# EAGLE design powerSwitch001 (EAGLE 5.10)

## Sheet 1 of 2
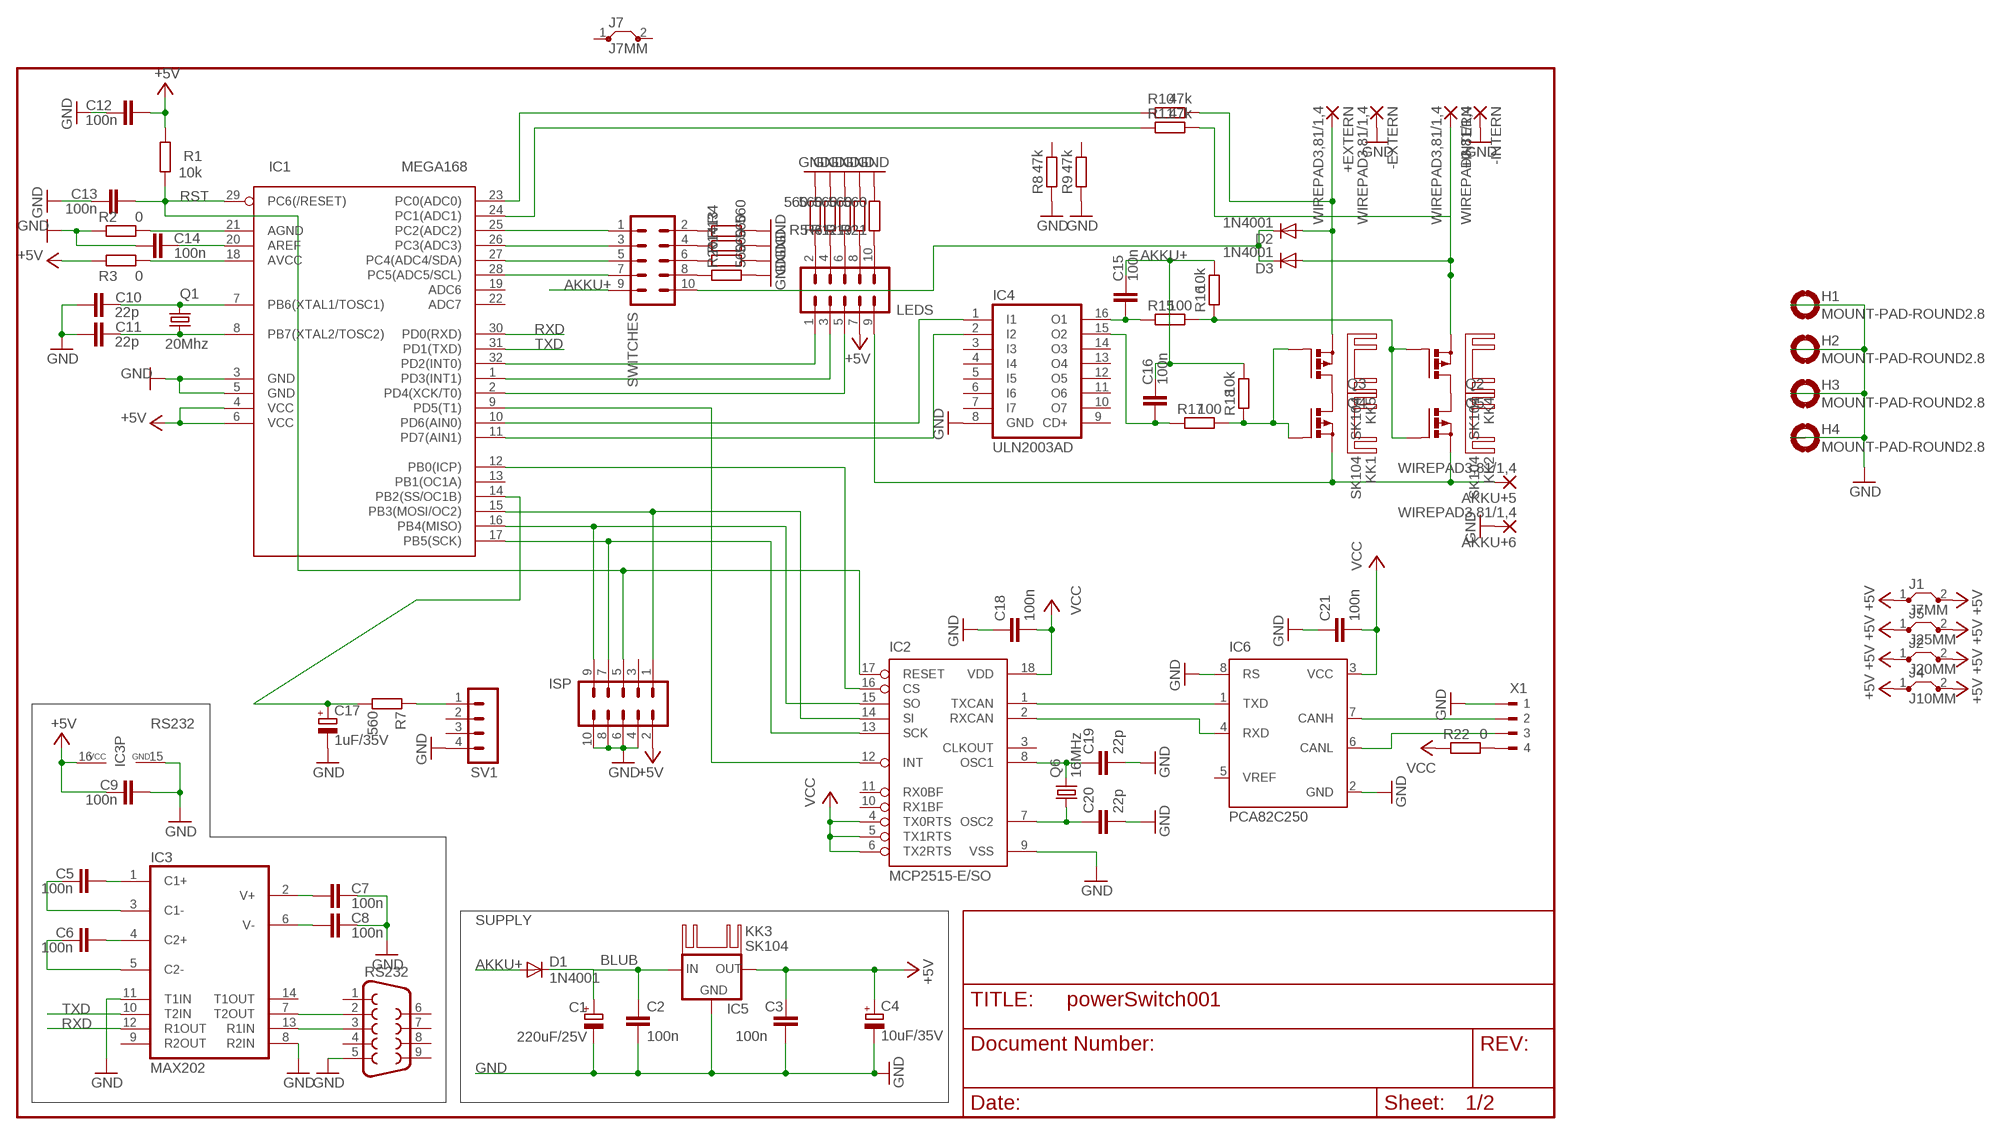
[diagram p0: schematic, sheet 1]

### Parts
+EXTERN  WIREPAD3,81/1,4  [3,81/1,4]
+INTERN  WIREPAD3,81/1,4  [3,81/1,4]
-EXTERN  WIREPAD3,81/1,4  [3,81/1,4]
-INTERN  WIREPAD3,81/1,4  [3,81/1,4]
AKKU+5  WIREPAD3,81/1,4  [3,81/1,4]
AKKU+6  WIREPAD3,81/1,4  [3,81/1,4]
C1  220uF/25V  CPOL-EUE3.5-8  [E3,5-8]
C2  100n  C-EUC0603K  [C0603K]
C3  100n  C-EUC0603K  [C0603K]
C4  10uF/35V  CPOL-EUE2-5  [E2-5]
C5  100n  C-EUC0603K  [C0603K]
C6  100n  C-EUC0603K  [C0603K]
C7  100n  C-EUC0603K  [C0603K]
C8  100n  C-EUC0603K  [C0603K]
C9  100n  C-EUC0603K  [C0603K]
C10  22p  C-EUC0603K  [C0603K]
C11  22p  C-EUC0603K  [C0603K]
C12  100n  C-EUC0603K  [C0603K]
C13  100n  C-EUC0603K  [C0603K]
C14  100n  C-EUC0603K  [C0603K]
C15  100n  C-EUC0603K  [C0603K]
C16  100n  C-EUC0603K  [C0603K]
C17  1uF/35V  CPOL-EUE2-5  [E2-5]
C18  100n  C-EUC0603  [C0603]
C19  22p  C-EUC0603  [C0603]
C20  22p  C-EUC0603  [C0603]
C21  100n  C-EUC0603  [C0603]
D1  1N4001  1N4004  [DO41-10]
D2  1N4001  1N4004  [DO41-10]
D3  1N4001  1N4004  [DO41-10]
H1  MOUNT-PAD-ROUND2.8  [2,8-PAD]
H2  MOUNT-PAD-ROUND2.8  [2,8-PAD]
H3  MOUNT-PAD-ROUND2.8  [2,8-PAD]
H4  MOUNT-PAD-ROUND2.8  [2,8-PAD]
IC1  MEGA168  MEGA8-AI  [TQFP32-08]
IC2  MCP2515-E/SO  [SO18L]
IC3  MAX202  MAX3232CSE  [SO16]
IC4  ULN2003AD  [SO16]
IC5  78XXS  [78XXS]
IC6  PCA82C250  [DIL08]
ISP  socket  MA05-2  [MA05-2]
J1  J7MM  [07]
J2  J20MM  [20]
J4  J10MM  [10]
J5  J25MM  [25]
J7  J7MM  [07]
KK1  SK104  [SK104]
KK2  SK104  [SK104]
KK3  SK104  [SK104]
KK4  SK104  [SK104]
KK5  SK104  [SK104]
LEDS  leds  MA05-2  [MA05-2]
Q1  20Mhz  CRYTALHC49U-V  [HC49U-V]
Q2  PMOSFET_PTO220BV  [TO220BV]
Q3  PMOSFET_PTO220BV  [TO220BV]
Q4  PMOSFET_PTO220BV  [TO220BV]
Q5  PMOSFET_PTO220BV  [TO220BV]
Q6  16MHz  CRYSTALHC49U-V  [HC49U-V]
R1  10k  R-EU_R0805  [R0805]
R2  0  R-EU_R0805  [R0805]
R3  0  R-EU_R0805  [R0805]
R4  560  R-EU_R0805  [R0805]
R5  560  R-EU_R0805  [R0805]
R6  560  R-EU_R0805  [R0805]
R7  560  R-EU_R0805  [R0805]
R8  47k  R-EU_R0805  [R0805]
R9  47k  R-EU_R0805  [R0805]
R10  47k  R-EU_R0805  [R0805]
R11  47k  R-EU_R0805  [R0805]
R12  560  R-EU_R0805  [R0805]
R13  560  R-EU_R0805  [R0805]
R14  560  R-EU_R0805  [R0805]
R15  100  R-EU_R0805  [R0805]
R16  10k  R-EU_R0805  [R0805]
R17  100  R-EU_R0805  [R0805]
R18  10k  R-EU_R0805  [R0805]
R19  560  R-EU_R0805  [R0805]
R20  560  R-EU_R0805  [R0805]
R21  560  R-EU_R0805  [R0805]
R22  0  R-EU_R0805  [R0805]
RS232  socket  F09HP  [F09HP]
SV1  MA04-1  [MA04-1]
SWITCHES  switches  MA05-2  [MA05-2]
X1  90-4  [90-4]

### Nets
+5V: C3.1 C4.+ C9.1 C12.2 IC1.4(VCC) IC1.6(VCC) IC3.16(VCC) IC5.OUT ISP.2 J1.1 J1.2 J2.1 J2.2 J4.1 J4.2 J5.1 J5.2 LEDS.7 R1.2 R3.2
AKKU+: C15.2 C16.2 D1.A R16.1 R18.1 SWITCHES.9
BLUB: C1.+ C2.1 D1.C IC5.IN
GND: -EXTERN.1(P) -INTERN.1(P) AKKU+6.1(P) C1.- C2.2 C3.2 C4.- C7.2 C8.2 C9.2 C10.1 C11.1 C12.1 C13.1 C14.1 C17.- C18.1 C19.2 C20.2 C21.1 H1.B2,8(MOUNT) H2.B2,8(MOUNT) H3.B2,8(MOUNT) H4.B2,8(MOUNT) IC1.3(GND) IC1.5(GND) IC2.9(VSS) IC3.8(R2IN) IC3.11(T1IN) IC3.15(GND) IC4.8(GND) IC5.GND IC6.2(GND) IC6.8(RS) ISP.4 ISP.6 ISP.8 ISP.10 R2.2 R4.2 R5.2 R6.2 R8.2 R9.2 R12.2 R13.2 R14.2 R19.2 R20.2 R21.2 RS232.5 SV1.4 X1.1
INT: IC1.9(PD5(T1)) IC2.12(INT)
MISO: IC1.16(PB4(MISO)) IC2.15(SO) ISP.9
MOSI: IC1.15(PB3(MOSI/OC2)) IC2.14(SI) ISP.1
N$1: C17.+ IC1.14(PB2(SS/OC1B)) R7.2
N$2: IC3.13(R1IN) RS232.3
N$3: IC3.7(T2OUT) RS232.2
N$4: C5.2 IC3.1(C1+)
N$5: C6.2 IC3.4(C2+)
N$6: C5.1 IC3.3(C1-)
N$7: C6.1 IC3.5(C2-)
N$8: C7.1 IC3.2(V+)
N$9: C8.1 IC3.6(V-)
N$10: C10.2 IC1.7(PB6(XTAL1/TOSC1)) Q1.2
N$11: C11.2 IC1.8(PB7(XTAL2/TOSC2)) Q1.1
N$12: Q3.S Q4.S
N$13: C14.2 IC1.20(AREF)
N$14: IC1.18(AVCC) R3.1
N$15: IC1.21(AGND) R2.1
N$16: Q2.S Q5.S
N$17: +INTERN.1(P) D3.A Q2.D R11.1
N$18: R7.1 SV1.1
N$19: R13.1 SWITCHES.4
N$20: AKKU+5.1(P) LEDS.9 Q4.D Q5.D
N$21: IC1.24(PC1(ADC1)) R11.2
N$22: +EXTERN.1(P) D2.A Q3.D R10.1
N$24: IC1.23(PC0(ADC0)) R10.2
N$31: R4.1 SWITCHES.2
N$32: IC1.10(PD6(AIN0)) IC4.1(I1)
N$33: IC1.11(PD7(AIN1)) IC4.2(I2)
N$34: IC1.2(PD4(XCK/T0)) LEDS.5
N$35: IC1.1(PD3(INT1)) LEDS.3
N$36: R14.1 SWITCHES.6
N$37: IC2.1(TXCAN) IC6.1(TXD)
N$38: IC2.2(RXCAN) IC6.4(RXD)
N$40: IC1.32(PD2(INT0)) LEDS.1
N$41: LEDS.4 R6.1
N$42: C15.1 IC4.16(O1) R15.2
N$43: Q2.G Q5.G R15.1 R16.2
N$44: LEDS.6 R12.1
N$45: C16.1 IC4.15(O2) R17.2
N$46: Q3.G Q4.G R17.1 R18.2
N$47: R20.1 SWITCHES.8
N$48: C19.1 IC2.8(OSC1) Q6.2
N$49: C20.1 IC2.7(OSC2) Q6.1
N$50: IC6.7(CANH) X1.2
N$51: IC6.6(CANL) X1.3
N$52: LEDS.2 R5.1
N$53: LEDS.8 R19.1
N$54: LEDS.10 R21.1
N$55: IC1.25(PC2(ADC2)) SWITCHES.1
N$56: IC1.26(PC3(ADC3)) SWITCHES.3
N$57: D2.C D3.C SWITCHES.10
N$59: IC1.27(PC4(ADC4/SDA)) SWITCHES.5
N$60: IC1.28(PC5(ADC5/SCL)) SWITCHES.7
N$61: R22.1 X1.4
RST: C13.2 IC1.29(PC6(/RESET)) IC2.17(RESET) ISP.5 R1.1
RXD: IC1.30(PD0(RXD)) IC3.12(R1OUT)
SCK: IC1.17(PB5(SCK)) IC2.13(SCK) ISP.7
SS: IC1.12(PB0(ICP)) IC2.16(CS)
TXD: IC1.31(PD1(TXD)) IC3.10(T2IN)
VCC: C18.2 C21.2 IC2.4(TX0RTS) IC2.5(TX1RTS) IC2.6(TX2RTS) IC2.18(VDD) IC6.3(VCC) R22.2
Unconnected: IC1.13(PB1(OC1A)) IC1.19(ADC6) IC1.22(ADC7) IC2.3(CLKOUT) IC2.10(RX1BF) IC2.11(RX0BF) IC3.9(R2OUT) IC3.14(T1OUT) IC4.3(I3) IC4.4(I4) IC4.5(I5) IC4.6(I6) IC4.7(I7) IC4.9(CD+) IC4.10(O7) IC4.11(O6) IC4.12(O5) IC4.13(O4) IC4.14(O3) IC6.5(VREF) ISP.3 J7.1 J7.2 R8.1 R9.1 RS232.1 RS232.4 RS232.6 RS232.7 RS232.8 RS232.9 SV1.2 SV1.3

### Notes on the sheet
- RS232
- SUPPLY

## Sheet 2 of 2

## Library data of the parts
+EXTERN +INTERN -EXTERN -INTERN AKKU+5 AKKU+6 = wirepad:WIREPAD: Wire PAD connect wire on PCB
C1 C4 C17 = rcl:CPOL-EU: POLARIZED CAPACITOR, European symbol
C2 C3 C5-C16 C18-C21 = rcl:C-EU: CAPACITOR, European symbol
D1-D3 = diode:1N4004: DIODE general purpose rectifier, 1 A
H1-H4 = holes:MOUNT-PAD-ROUND: MOUNTING PAD, round
IC1 = atmel:MEGA8: MICROCONTROLLER 8 Kbytes FLASH 1 kbytes SRAM 512 bytes EEPROM USART 6-channel 10 bit ADC 2-channel 8 bit ADC Source: avr.lbr
IC2 = mcp2515:MCP2515
IC3 = maxim:MAX3232*: True RS-232 Transceivers 3.0V to 5.5V, Low-Power up to 1Mbps, Using Four 0.1µF External Capacitors Source: http://pdfserv.maxim-ic.com/en/ds/MAX3222-MAX3241.pdf
IC4 = uln-udn:ULN2003A: DRIVER ARRAY
IC5 = v-reg:78XXS: VOLTAGE REGULATOR
IC6 = micro-philips:PCA82C250: CAN CONTROLLER INTERFACE
ISP LEDS SWITCHES = con-lstb:MA05-2: PIN HEADER
J1 J2 J4 J5 J7 = jumper:J: Bridge
KK1-KK5 = heatsink:SK104: HEATSINK manufacturer Fischer/distributor Buerklin
Q1 = crystal:CRYTAL: CRYSTAL
Q2-Q5 = transistor-power:PMOSFET_P: Power MOSFET P-Channel
Q6 = crystal:CRYSTAL: CRYSTAL
R1-R22 = rcl:R-EU_: RESISTOR, European symbol
RS232 = con-subd:F09: SUB-D
SV1 = con-lstb:MA04-1: PIN HEADER
X1 = con-weidmueller-sl35:90-4: WEIDMUELLER CLAMP CONNECTOR

## Board
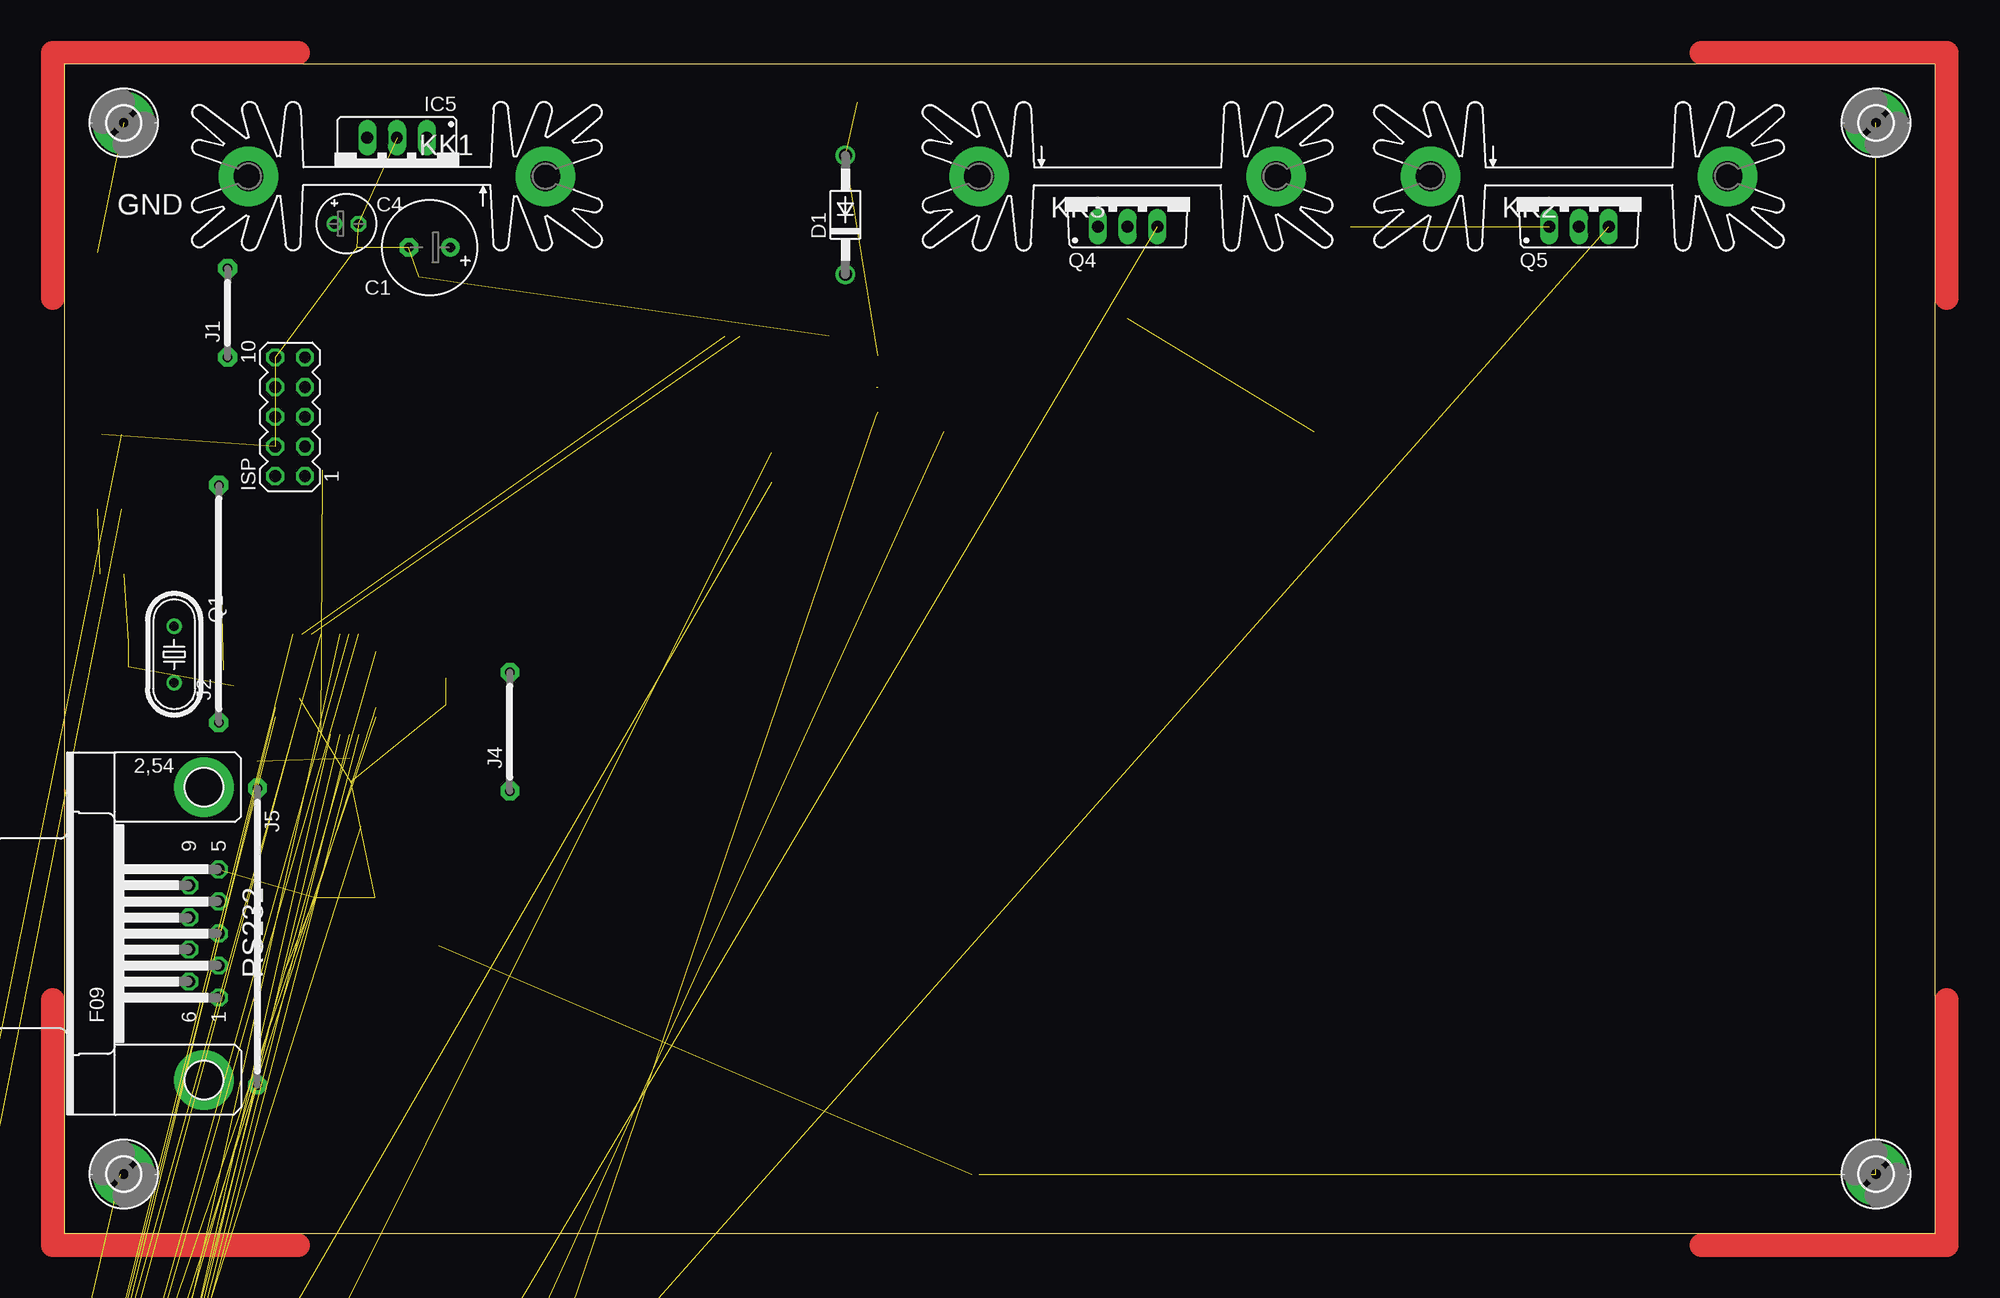
[diagram p1: board, top side]
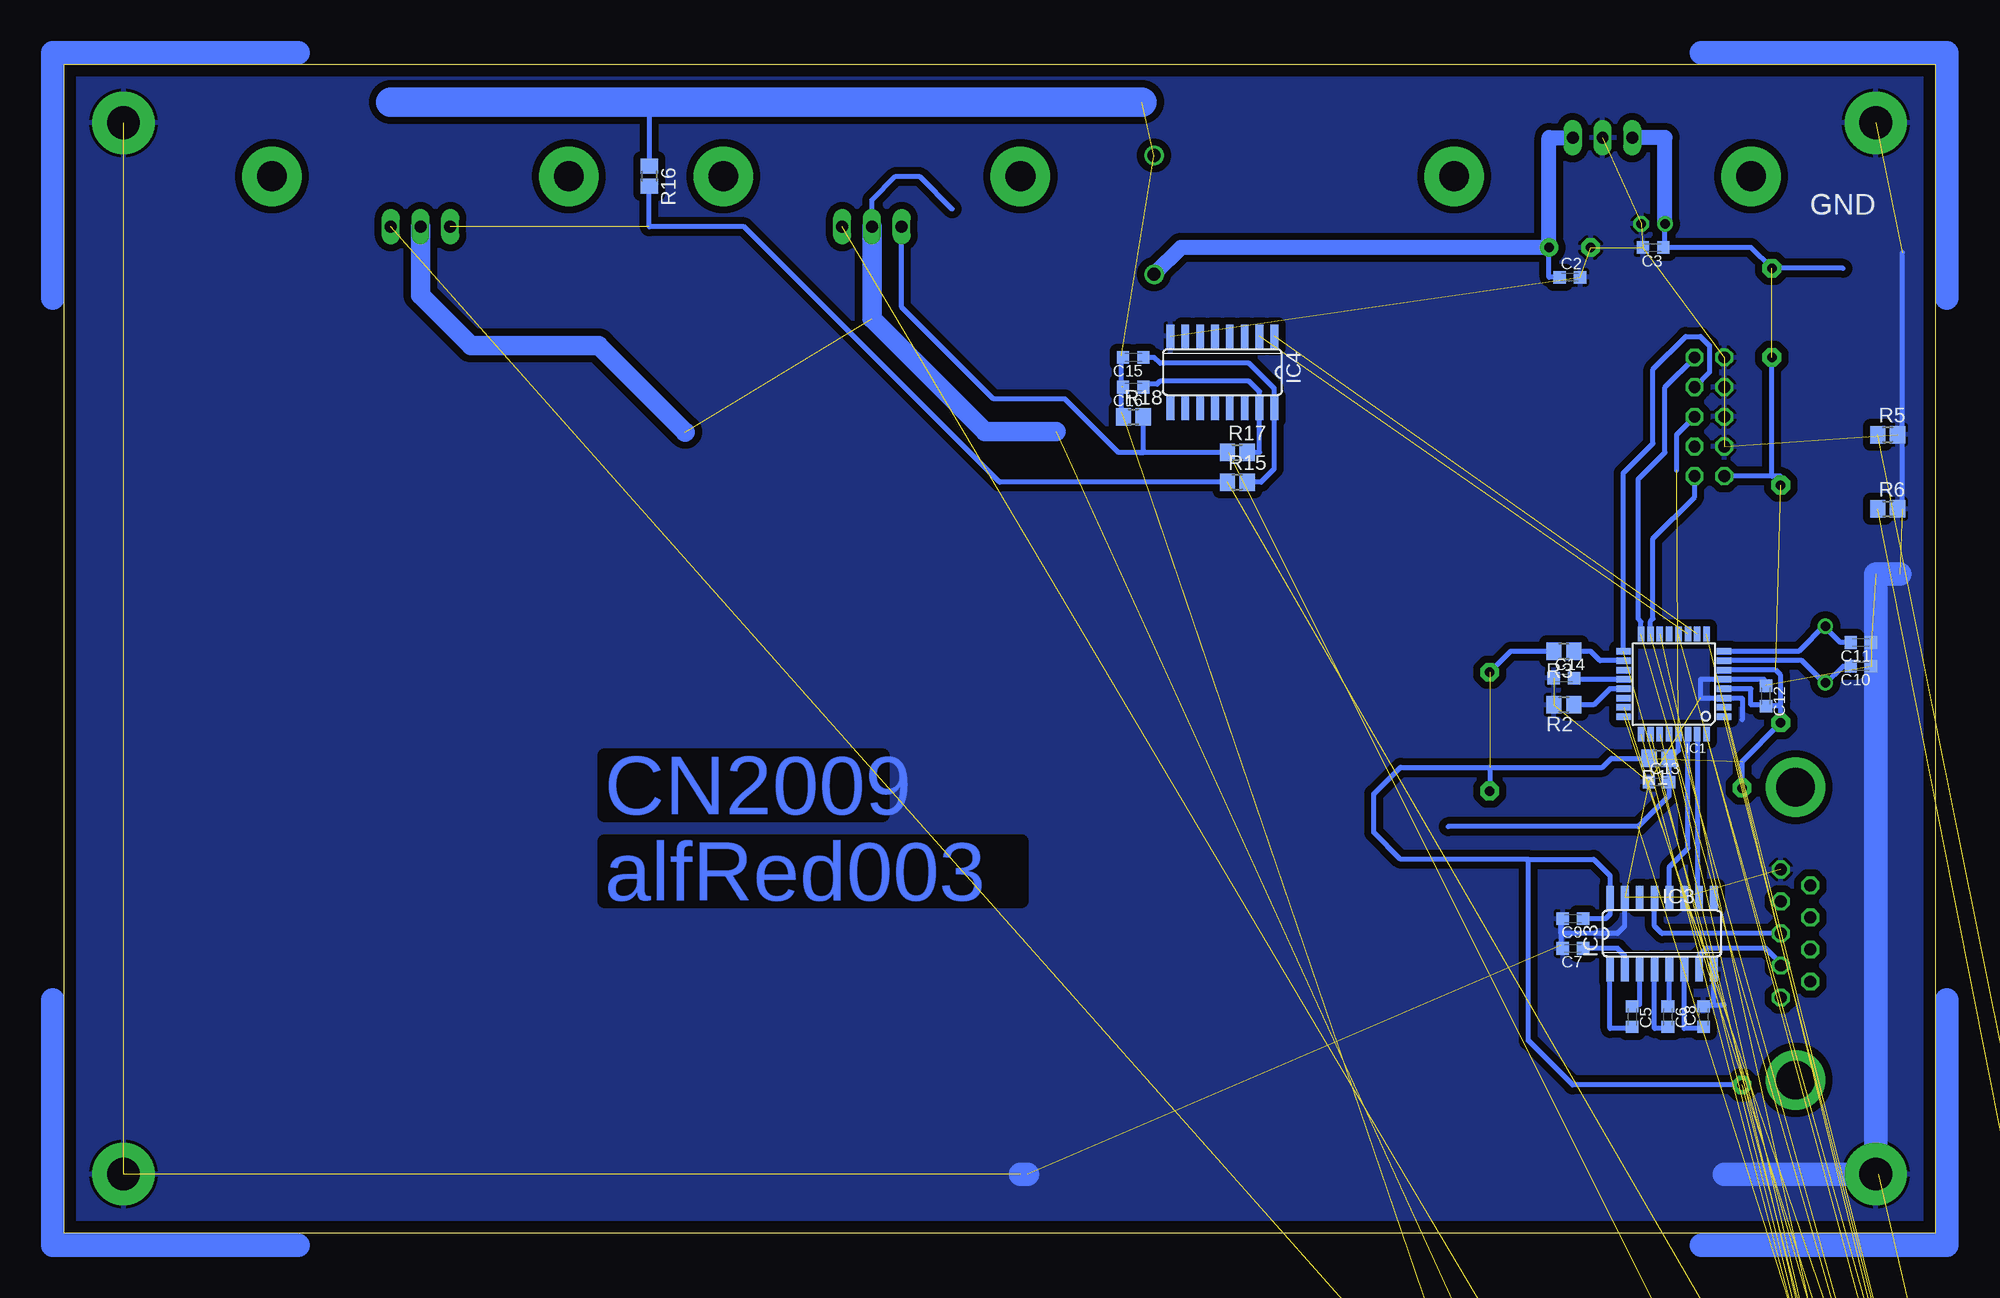
[diagram p2: board, bottom side, seen from below]

Size 160 x 100 mm. Coordinates in mm from the lower left corner, seen from the top.
Outline: 0,0 160,0 160,100 0,100 0,0
Copper layers (1*16): Top 0.035mm / dielectric 1.5mm / Bottom 0.035mm
Design rules "olimex_8mils": minimum track width 10mil, minimum drill 24mil, track to track 8mil, track to pad 8mil, pad to pad 8mil, via to via 8mil, smd to smd 8mil, copper to edge 40mil, drill to drill 10mil, minimum pad ring 10mil, minimum via ring 8mil, stop-mask expansion 0mil, vias tented up to drill 0mil, thermal gap 10mil

### Footprints (pad centres in the part's own frame; a part is rotated, then mirrored left to right if it is on the bottom)
3,81/1,4 = drill 1.397 pad 3.81 octagon: 1 0,0
E3,5-8 = drill 0.813 pad 1.6 round: + -1.778,0 | drill 0.813 pad 1.6 octagon: - 1.778,0
C0603K = smd 1.05 x 1.08: 1 -0.875,0; 2 0.875,0
E2-5 = drill 0.813 pad 1.27 round: + -1.016,0 | drill 0.813 pad 1.27 octagon: - 1.016,0
C0603 = smd 1.1 x 1: 1 -0.85,0; 2 0.85,0
DO41-10 = drill 1.118 round: A 5.08,0; C -5.08,0
2,8-PAD = drill 2.8 pad 5.334 round: B2,8 0,0
TQFP32-08 = smd 1.27 x 0.559: 1 -4.293,2.8; 2 -4.293,2; 3 -4.293,1.2; 4 -4.293,0.4; 5 -4.293,-0.4; 6 -4.293,-1.2; 7 -4.293,-2; 8 -4.293,-2.8; 17 4.293,-2.8; 18 4.293,-2; 19 4.293,-1.2; 20 4.293,-0.4; 21 4.293,0.4; 22 4.293,1.2; 23 4.293,2; 24 4.293,2.8 | smd 0.559 x 1.27: 9 -2.8,-4.293; 10 -2,-4.293; 11 -1.2,-4.293; 12 -0.4,-4.293; 13 0.4,-4.293; 14 1.2,-4.293; 15 2,-4.293; 16 2.8,-4.293; 25 2.8,4.293; 26 2,4.293; 27 1.2,4.293; 28 0.4,4.293; 29 -0.4,4.293; 30 -1.2,4.293; 31 -2,4.293; 32 -2.8,4.293
SO18L = smd 0.66 x 2.032: 1 -5.08,-4.902; 2 -3.81,-4.902; 3 -2.54,-4.902; 4 -1.27,-4.902; 5 0,-4.902; 6 1.27,-4.902; 7 2.54,-4.902; 8 3.81,-4.902; 9 5.08,-4.902; 10 5.08,4.902; 11 3.81,4.902; 12 2.54,4.902; 13 1.27,4.902; 14 0,4.902; 15 -1.27,4.902; 16 -2.54,4.902; 17 -3.81,4.902; 18 -5.08,4.902
SO16 = smd 0.66 x 2.032: 1 -4.445,-3.073; 2 -3.175,-3.073; 3 -1.905,-3.073; 4 -0.635,-3.073; 5 0.635,-3.073; 6 1.905,-3.073; 7 3.175,-3.073; 8 4.445,-3.073; 9 4.445,3.073; 10 3.175,3.073; 11 1.905,3.073; 12 0.635,3.073; 13 -0.635,3.073; 14 -1.905,3.073; 15 -3.175,3.073; 16 -4.445,3.073
78XXS = drill 1.016 long: GND 0,-2.54; IN -2.54,-2.54; OUT 2.54,-2.54
DIL08 = drill 0.813 long: 1 -3.81,-3.81; 2 -1.27,-3.81; 3 1.27,-3.81; 4 3.81,-3.81; 5 3.81,3.81; 6 1.27,3.81; 7 -1.27,3.81; 8 -3.81,3.81
MA05-2 = drill 1.016 octagon: 1 -5.08,-1.27; 2 -5.08,1.27; 3 -2.54,-1.27; 4 -2.54,1.27; 5 0,-1.27; 6 0,1.27; 7 2.54,-1.27; 8 2.54,1.27; 9 5.08,-1.27; 10 5.08,1.27
07 = drill 0.813 pad 1.6 octagon: 1 -3.81,0; 2 3.81,0
20 = drill 0.813 pad 1.6 octagon: 1 -10.16,0; 2 10.16,0
10 = drill 0.813 pad 1.6 octagon: 1 -5.08,0; 2 5.08,0
25 = drill 0.813 pad 1.6 octagon: 1 -12.7,0; 2 12.7,0
SK104 = drill 2.54 pad 5.08 round: A2,5 -12.7,-0.762; B2,5 12.7,-0.762
HC49U-V = drill 0.813 round: 1 -2.413,0; 2 2.413,0
TO220BV = drill 1.016 long: D 0,-2.54; G -2.54,-2.54; S 2.54,-2.54
R0805 = smd 1.3 x 1.5: 1 -0.85,0; 2 0.85,0
F09HP = drill 1.016 octagon: 1 -5.486,-1.27; 2 -2.743,-1.27; 3 0,-1.27; 4 2.743,-1.27; 5 5.486,-1.27; 6 -4.115,1.27; 7 -1.372,1.27; 8 1.372,1.27; 9 4.115,1.27 | drill 3.302 pad 5.08 round: G1 -12.522,0; G2 12.522,0
MA04-1 = drill 1.016 long: 1 -3.81,0; 2 -1.27,0; 3 1.27,0; 4 3.81,0
90-4 = drill 1.422 long: 1 -5.25,5.25; 2 -1.75,5.25; 3 1.75,5.25; 4 5.25,5.25

### Placement (x,y rotation side)
+EXTERN  -28.96,-133.35 0 top  (outside the outline)
+INTERN  -28.96,-146.56 0 top  (outside the outline)
-EXTERN  -28.96,-139.95 0 top  (outside the outline)
-INTERN  -28.96,-153.16 0 top  (outside the outline)
AKKU+5  -28.96,-159.77 0 top  (outside the outline)
AKKU+6  -28.96,-166.37 0 top  (outside the outline)
C1  31.24,84.33 180 top
C2  31.24,81.79 0 bottom
C3  24.13,84.33 180 bottom
C4  24.13,86.36 0 top
C5  25.91,18.54 270 bottom
C6  22.86,18.54 270 bottom
C7  30.99,24.38 180 bottom
C8  19.81,18.54 90 bottom
C9  30.99,26.92 180 bottom
C10  6.35,48.51 180 bottom
C11  6.35,50.55 180 bottom
C12  14.48,45.97 270 bottom
C13  23.62,38.61 0 bottom
C14  31.75,47.5 0 bottom
C15  68.58,74.93 180 bottom
C16  68.58,72.39 180 bottom
C17  -29.72,-192.79 0 top  (outside the outline)
C18  -56.13,-227.33 0 top  (outside the outline)
C19  -44.45,-227.33 0 top  (outside the outline)
C20  -39.37,-227.33 0 top  (outside the outline)
C21  -50.29,-227.33 0 top  (outside the outline)
D1  66.8,87.12 90 top
D2  -25.15,-172.21 0 top  (outside the outline)
D3  -25.4,-179.83 0 top  (outside the outline)
H1  154.94,5.08 90 top
H2  5.08,5.08 90 top
H3  5.08,95 90 top
H4  154.94,95 90 top
IC1  22.35,46.99 180 bottom
IC2  -49.53,-218.19 0 top  (outside the outline)
IC3  23.37,25.65 0 bottom
IC4  60.96,73.66 180 bottom
IC5  28.45,91.19 180 top
IC6  -50.29,-204.98 0 top  (outside the outline)
ISP  19.3,69.85 90 top
J1  13.97,78.74 90 top
J2  13.21,53.85 90 top
J4  38.1,42.93 90 top
J5  16.51,25.4 270 top
J7  -53.34,-233.17 0 top  (outside the outline)
KK1  28.45,89.66 180 top
KK2  129.54,91.19 0 top
KK3  90.93,91.19 0 top
KK4  -13.46,-99.57 0 top  (outside the outline)
KK5  -13.46,-121.16 0 top  (outside the outline)
LEDS  -51.82,-239.52 0 top  (outside the outline)
Q1  9.4,49.53 270 top
Q2  -25.65,-86.36 0 top  (outside the outline)
Q3  -25.65,-107.95 0 top  (outside the outline)
Q4  90.93,88.65 0 top
Q5  129.54,88.65 0 top
Q6  -33.78,-216.66 0 top  (outside the outline)
R1  23.62,40.64 180 bottom
R2  31.75,45.21 180 bottom
R3  31.75,49.78 180 bottom
R4  -56.64,-277.37 0 top  (outside the outline)
R5  4.06,68.33 0 bottom
R6  4.06,61.98 0 bottom
R7  -36.07,-193.04 0 top  (outside the outline)
R8  -40.13,-193.04 0 top  (outside the outline)
R9  -45.21,-193.29 0 top  (outside the outline)
R10  -50.29,-193.55 0 top  (outside the outline)
R11  -55.88,-193.8 0 top  (outside the outline)
R12  -56.64,-247.9 0 top  (outside the outline)
R13  -50.8,-277.37 0 top  (outside the outline)
R14  -44.96,-277.37 0 top  (outside the outline)
R15  59.69,64.26 0 bottom
R16  109.98,90.42 270 bottom
R17  59.69,66.8 0 bottom
R18  68.58,69.85 0 bottom
R19  -56.64,-254.25 0 top  (outside the outline)
R20  -56.64,-283.97 0 top  (outside the outline)
R21  -56.64,-260.6 0 top  (outside the outline)
R22  -62.23,-284.23 0 top  (outside the outline)
RS232  11.94,25.65 90 top
SV1  -25.15,-187.45 0 top  (outside the outline)
SWITCHES  -51.82,-268.99 0 top  (outside the outline)
X1  -35.31,-205.74 0 top  (outside the outline)

### Tracks (layer width: path | path; a pad name or v marks a point on that pad's centre or on a via)
+5V  (5 unrouted)
  Bottom 0.406: 30.23,26.92 C9.1 28.19,26.92 27.81,27.3 IC3.16 27.81,30.61 29.21,32 34.8,32 | 24.38,40.64 R1.2 27.69,40.64 28.45,39.88 38.1,39.88 | IC1.4 15.75,46.59 15.75,45.21 14.73,45.21 C12.2 | IC1.6 13.65,48.19 13.21,47.75 13.21,45.72 | C12.2 13.32,45.1 13.21,45.72 | C12.2 14.48,45.21 | 13.97,64.77 13.21,64.77 J2.2 | 13.97,64.77 ISP.2 | 13.21,45.72 J2.1 16.51,40.39 J5.1 | 13.97,64.77 J1.1 | 23.11,84.33 C4.+ | 38.1,39.88 45.72,39.88 48.01,37.59 48.01,34.29 45.72,32 34.8,32 | J4.2 36.32,49.78 R3.2 | 38.1,39.88 J4.1 | 23.11,84.33 C3.1 | 23.11,84.33 15.75,84.33 J1.2 7.87,82.55 | J5.2 30.99,12.7 34.8,16.51 34.8,32
  Bottom 1.27: C4.+ 23.11,93.73 IC5.OUT
AKKU+  (5 unrouted)
  Bottom 0.406: 109.98,96.77 R16.1 | 69.6,75.07 C15.2 69.6,74.93 69.6,72.39 69.6,70.27
  Bottom 1.676: 132.08,96.77 132.08,97.03
  Bottom 2.54: 67.82,96.77 93.47,96.77 109.98,96.77 132.08,96.77
BLUB
  Bottom 0.406: C1.+ 33.02,81.79 C2.1
  Bottom 1.27: IC5.IN 33.02,93.73 C1.+ 64.52,84.33 D1.C
GND  (47 unrouted)
  Bottom 0.406: IC3.15 26.54,26.29 27.18,25.65 32,25.65 32,26.67 | C12.1 14.73,47.24 14.62,47.39 IC1.5 20.07,47.39 20.07,45.79 IC1.3 16.51,45.79 16.51,43.94 | 2.79,83.91 2.79,68.33 R5.2 2.79,67.91 2.79,61.98 R6.2 | C7.2 32,24.64 32,26.67 | 32,26.67 C9.2 | C8.2 19.81,19.56 18.92,19.56 | 18.92,19.56 IC3.8 | 18.92,19.56 18.03,19.56
  Bottom 2: 4.83,5.08 H2.B2,8 | H2.B2,8 18.03,5.08 | H2.B2,8 5.08,56.39 3.05,56.39 | 78.23,5.08 77.62,5.08
  pour Top (isolate 0.254): -27.94,55.88 -26.67,53.34 -26.67,2.54 -27.94,5.08
  pour Bottom (isolate 0.61): -0.25,100.33 160.27,100.33 160.27,-0.25 -0.25,-0.25
INT  (1 unrouted)
MISO  (1 unrouted)
  Bottom 0.406: ISP.9 23.12,72.38 23.12,66.8 25.4,64.52 25.4,52.58 25.15,52.33 IC1.16
MOSI  (1 unrouted)
  Bottom 0.406: IC1.15 24.35,52.36 24.13,52.58 24.13,59.44 20.57,62.99 ISP.1
N$1  (2 unrouted)
N$2
  Bottom 0.406: IC3.13 24,26.29 23.37,25.65 RS232.3
N$3
  Bottom 0.406: 20.19,22.48 IC3.7 20.19,23.75 19.56,24.38 14.48,24.38 13.21,23.11
  Bottom 0.61: RS232.2 13.21,23.11
N$4
  Bottom 0.406: C5.2 26.42,17.53 27.81,17.53 IC3.1
N$5
  Bottom 0.406: C6.2 23.11,17.53 24,17.53 IC3.4
N$6
  Bottom 0.406: C5.1 25.91,19.56 25.27,19.56 IC3.3
N$7
  Bottom 0.406: C6.1 23.11,19.56 22.73,19.56 IC3.5
N$8
  Bottom 0.406: IC3.2 26.54,23.75 27.18,24.38 C7.1
N$9
  Bottom 0.406: C8.1 19.81,17.53 21.46,17.53 IC3.6
N$10
  Bottom 0.406: IC1.7 11.4,48.99 9.4,46.99 | 9.4,46.99 Q1.2 | C10.2 7.87,48.51 9.4,46.99
N$11
  Bottom 0.406: IC1.8 11.68,49.79 9.4,52.07 Q1.1 9.4,51.82 8.13,50.55 C11.2
N$12  (1 unrouted)
N$13
  Bottom 0.406: C14.2 30.99,47.5 30.88,47.39 IC1.20
N$14
  Bottom 0.406: IC1.18 28.67,48.99 29.46,49.78 R3.1 30.99,49.78
N$15
  Bottom 0.406: IC1.21 27.83,46.59 29.21,45.21 R2.1
N$16  (1 unrouted)
N$17  (3 unrouted)
N$18  (1 unrouted)
N$19  (1 unrouted)
N$20  (3 unrouted)
  Bottom 0.406: 84.07,87.63 86.87,90.42 88.9,90.42 90.93,88.39 Q4.D
  Bottom 1.676: 106.91,68.55 114.3,75.95 122.68,75.95 125.22,75.95 129.54,80.26 Q5.D | Q4.D 90.93,78.23 81.28,68.58 75.18,68.58
N$21  (1 unrouted)
N$22  (3 unrouted)
N$23
  Top 2: 20,-1 -1,-1 -1,20
N$24  (1 unrouted)
N$25
  Top 2: 140,-1 161,-1 161,20
N$26
  Top 2: 20,101 -1,101 -1,80
N$27
  Top 2: 161,80 161,101 140,101
N$28
  Bottom 2: 20,-1 -1,-1 -1,20
N$29
  Bottom 2: 140,-1 161,-1 161,20
N$30
  Bottom 2: 20,101 -1,101 -1,80
N$31  (1 unrouted)
N$32  (1 unrouted)
N$33  (1 unrouted)
N$34  (1 unrouted)
N$35  (1 unrouted)
N$36  (1 unrouted)
N$37  (1 unrouted)
N$38  (1 unrouted)
N$39
  Bottom 2: 161,80 161,101 140,101
N$40  (1 unrouted)
N$41  (1 unrouted)
N$42
  Bottom 0.406: C15.1 66.8,74.93 66.29,74.42 58.67,74.42 56.52,72.26 IC4.16 56.52,65.41 57.66,64.26 R15.2
N$43  (2 unrouted)
  Bottom 0.406: R15.1 80.01,64.26 101.85,86.11 109.98,86.11 R16.2
N$44  (1 unrouted)
N$45
  Bottom 0.406: C16.1 67.7,72.5 67.56,72.64 66.55,72.64 66.29,72.9 58.67,72.9 57.78,72.01 IC4.15 57.78,66.8 R17.2
N$46  (1 unrouted)
  Bottom 0.406: 60.45,66.8 R17.1 68.07,66.8 | Q4.G 88.39,79.25 80.52,71.37 74.42,71.37 69.85,66.8 68.07,66.8 | R18.2 67.73,66.8 68.07,66.8
N$47  (1 unrouted)
N$48  (2 unrouted)
N$49  (2 unrouted)
N$50  (1 unrouted)
N$51  (1 unrouted)
N$52  (1 unrouted)
N$53  (1 unrouted)
N$54  (1 unrouted)
N$55  (1 unrouted)
N$56  (1 unrouted)
N$57  (2 unrouted)
N$59  (1 unrouted)
N$60  (1 unrouted)
N$61  (1 unrouted)
RST  (2 unrouted)
  Bottom 0.406: ISP.5 22.1,68.33 22.1,65.28 | IC1.29 21.95,41.29 22.61,40.64 | 22.61,40.64 R1.1 | 22.61,40.64 22.75,40.5 C13.2 22.75,37.45 25.4,34.8 41.66,34.8
RXD
  Bottom 0.406: IC1.30 21.15,32.95 22.73,31.37 IC3.12
SCK  (1 unrouted)
  Bottom 0.406: IC1.17 26.66,49.79 26.67,49.78 26.67,65.02 24.13,67.56 24.13,73.91 21.34,76.71 20.07,76.71 19.3,75.95 19.3,73.66 ISP.7
SS  (1 unrouted)
TXD
  Bottom 0.406: IC1.31 20.33,42.67 20.32,42.67 20.32,28.85 IC3.10
VCC  (7 unrouted)

### Text on the board
Bottom: CN2009 | alfRed003
tNames: GND
bNames: GND